# Altium schematic sheet Root.SchDoc
size A4; SheetNumber: 1; SheetTotal: 8
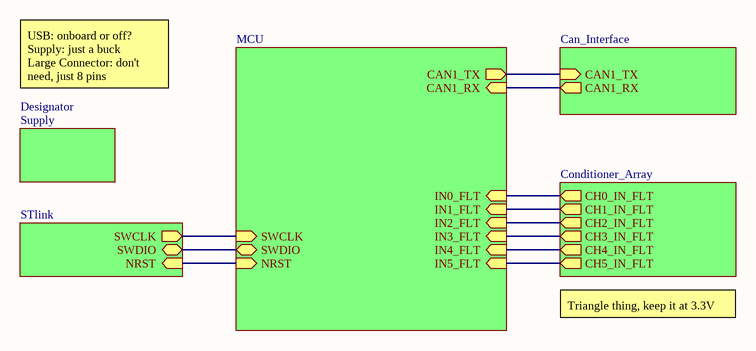
[diagram p0: Root.SchDoc]

## Sub-sheets
Can_Interface = Can_Interface: CAN1_TX (in), CAN1_RX (out)
Conditioner_Array = Conditioner_Array: CH0_IN_FLT (out), CH1_IN_FLT (out), CH2_IN_FLT (out), CH3_IN_FLT (out), CH4_IN_FLT (out), CH5_IN_FLT (out)
Designator = Supply: no entries
MCU = MCU: IN1_FLT (in), IN2_FLT (in), IN3_FLT (in), IN4_FLT (in), IN5_FLT (in), IN0_FLT (in), SWCLK (in), SWDIO (bidir), CAN1_TX (out), CAN1_RX (in), NRST (in)
STlink = STlink: SWDIO (bidir), SWCLK (out), NRST (in)

## Nets
(unnamed): sheet MCU/IN1_FLT, sheet Conditioner_Array/CH1_IN_FLT
(unnamed): sheet MCU/IN2_FLT, sheet Conditioner_Array/CH2_IN_FLT
(unnamed): sheet MCU/IN3_FLT, sheet Conditioner_Array/CH3_IN_FLT
(unnamed): sheet MCU/IN4_FLT, sheet Conditioner_Array/CH4_IN_FLT
(unnamed): sheet MCU/IN5_FLT, sheet Conditioner_Array/CH5_IN_FLT
(unnamed): sheet MCU/IN0_FLT, sheet Conditioner_Array/CH0_IN_FLT
(unnamed): sheet MCU/SWCLK, sheet STlink/SWCLK
(unnamed): sheet MCU/SWDIO, sheet STlink/SWDIO
(unnamed): sheet MCU/CAN1_TX, sheet Can_Interface/CAN1_TX
(unnamed): sheet MCU/CAN1_RX, sheet Can_Interface/CAN1_RX
(unnamed): sheet MCU/NRST, sheet STlink/NRST

## Notes on the sheet
- USB: onboard or off?
  Supply: just a buck
  Large Connector: don't need, just 8 pins
- Triangle thing, keep it at 3.3V